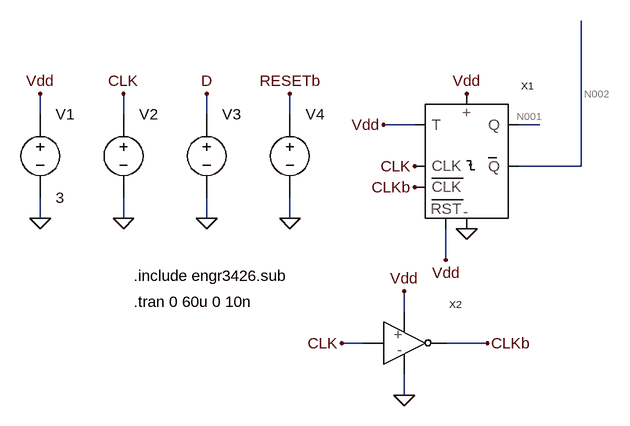
[diagram p0: schematic FlipFlop_test - Copy.asc]
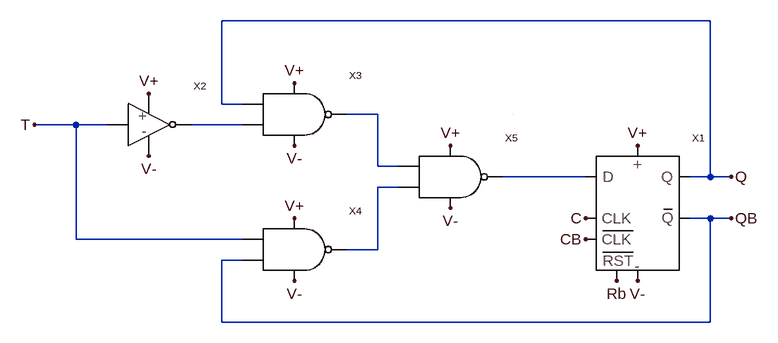
[diagram p1: sub-circuit t_flipflopreset_fe.asc]
FlipFlop_test - Copy.asc, the LTspice schematic file:
Version 4
SHEET 1 880 680
WIRE -464 80 -464 48
WIRE -336 80 -336 48
WIRE -208 80 -208 48
WIRE -80 80 -80 48
WIRE 112 96 64 96
WIRE 304 96 272 96
WIRE 368 160 368 -64
WIRE 368 160 272 160
WIRE -464 240 -464 208
WIRE -336 240 -336 208
WIRE -208 240 -208 208
WIRE -80 240 -80 208
WIRE 160 304 160 256
WIRE 96 384 96 352
WIRE 32 432 0 432
WIRE 224 432 160 432
WIRE 96 512 96 480
FLAG -464 240 0
FLAG -464 48 Vdd
FLAG -336 240 0
FLAG -336 48 CLK
FLAG -208 240 0
FLAG -208 48 D
FLAG 96 512 0
FLAG 96 352 Vdd
FLAG 0 432 CLK
FLAG 224 432 CLKb
FLAG 112 160 CLK
FLAG 112 192 CLKb
FLAG 192 256 0
FLAG 192 48 Vdd
FLAG -80 240 0
FLAG -80 48 RESETb
FLAG 160 304 Vdd
FLAG 64 96 Vdd
SYMBOL cktsym\\vsource -464 144 R0
WINDOW 123 0 0 Left 2
WINDOW 39 0 0 Left 2
SYMATTR Value 3
SYMATTR InstName V1
SYMBOL cktsym\\vsource -336 144 R0
WINDOW 3 48 16 Invisible 2
WINDOW 123 0 0 Left 2
WINDOW 39 0 0 Left 2
SYMATTR Value PULSE(0 3 5u 1n 1n 10u 20u)
SYMATTR InstName V2
SYMBOL cktsym\\vsource -208 144 R0
WINDOW 3 48 16 Invisible 2
WINDOW 123 0 0 Left 2
WINDOW 39 0 0 Left 2
SYMATTR Value PULSE(0 3 0.5u 1n 1n 20u 40u)
SYMATTR InstName V3
SYMBOL Inverter 96 432 R0
SYMATTR InstName X2
SYMBOL cktsym\\vsource -80 144 R0
WINDOW 3 48 12 Invisible 2
WINDOW 123 0 0 Left 2
WINDOW 39 0 0 Left 2
SYMATTR Value PWL(0 3 10u 3 10.05u 0 12u 0 12.05u .7 60u .7)
SYMATTR InstName V4
SYMBOL T_FlipFlopReset_FE 160 192 R0
SYMATTR InstName X1
TEXT -320 328 Left 2 !.include engr3426.sub
TEXT -320 368 Left 2 !.tran 0 60u 0 10n

t_flipflopreset_fe.asc, the sub-circuit schematic file:
Version 4
SHEET 1 880 680
WIRE 304 -144 -448 -144
WIRE -448 -16 -448 -144
WIRE -416 -16 -448 -16
WIRE -208 0 -256 0
WIRE -672 16 -736 16
WIRE -624 16 -672 16
WIRE -416 16 -496 16
WIRE -208 80 -208 0
WIRE -176 80 -208 80
WIRE 112 96 -16 96
WIRE 304 96 304 -144
WIRE 304 96 272 96
WIRE 336 96 304 96
WIRE -176 112 -208 112
WIRE 304 160 272 160
WIRE 336 160 304 160
WIRE -672 192 -672 16
WIRE -416 192 -672 192
WIRE -208 208 -208 112
WIRE -208 208 -256 208
WIRE -416 224 -448 224
WIRE -448 320 -448 224
WIRE 304 320 304 160
WIRE 304 320 -448 320
WIRE 0 0 0 0
FLAG 112 160 C
FLAG 112 192 CB
FLAG 160 256 Rb
FLAG -336 -48 V+
FLAG -336 48 V-
FLAG -336 160 V+
FLAG -336 256 V-
FLAG 192 48 V+
FLAG 192 256 V-
FLAG -560 -32 V+
FLAG -560 64 V-
FLAG -736 16 T
FLAG 336 96 Q
FLAG 336 160 QB
FLAG -96 48 V+
FLAG -96 144 V-
SYMBOL Inverter -560 16 R0
SYMATTR InstName X2
SYMATTR SpiceLine nmosL=0.9u nmosW=3u pmosL=0.9u pmosW=6u
SYMBOL FlipFlop 192 160 R0
SYMATTR InstName X1
SYMATTR SpiceLine nmosL=0.9u nmosW=3u pmosL=0.9u pmosW=6u
SYMBOL NAND -336 0 R0
SYMATTR InstName X3
SYMATTR SpiceLine nmosL=0.9u nmosW=3u pmosL=0.9u pmosW=6u
SYMBOL NAND -336 208 R0
SYMATTR InstName X4
SYMATTR SpiceLine nmosL=0.9u nmosW=3u pmosL=0.9u pmosW=6u
SYMBOL NAND -96 96 R0
SYMATTR InstName X5
SYMATTR SpiceLine nmosL=0.9u nmosW=3u pmosL=0.9u pmosW=6u

The netlist it stands for:
* FlipFlop_test - Copy.asc
V1 Vdd 0 3
V2 CLK 0 PULSE(0 3 5u 1n 1n 10u 20u)
V3 D 0 PULSE(0 3 0.5u 1n 1n 20u 40u)
XX2 CLK CLKb Vdd 0 Inverter  ; pins IN OUT pos neg
V4 RESETb 0 PWL(0 3 10u 3 10.05u 0 12u 0 12.05u .7 60u .7)
XX1 Vdd CLKb N001 N002 0 Vdd CLK Vdd t_flipflopreset_fe

* block symbol definitions
.subckt t_flipflopreset_fe T CB Q QB V- V+ C Rb
XX2 T N002 V+ V- Inverter nmosL=0.9u nmosW=3u pmosL=0.9u pmosW=6u  ; pins IN OUT pos neg
XX1 N003 C CB Q QB Rb V+ V- FlipFlop nmosL=0.9u nmosW=3u pmosL=0.9u pmosW=6u  ; pins D CLK CLKb Q Qb RESETb pos neg
XX3 Q N001 N002 V+ V- NAND nmosL=0.9u nmosW=3u pmosL=0.9u pmosW=6u  ; pins A OUT B Vdd GROUND
XX4 T N004 QB V+ V- NAND nmosL=0.9u nmosW=3u pmosL=0.9u pmosW=6u  ; pins A OUT B Vdd GROUND
XX5 N001 N003 N004 V+ V- NAND nmosL=0.9u nmosW=3u pmosL=0.9u pmosW=6u  ; pins A OUT B Vdd GROUND
.ends t_flipflopreset_fe

.include engr3426.sub
.tran 0 60u 0 10n
.backanno
.end

* Results of the author's LTspice run, read from the files saved beside the schematic
* Operating Point, zero values left out:
*   V(vdd) = 3 V
*   V(clkb) = 3 V
*   V(resetb) = 3 V
*   V(n002) = 1.048 V
*   V(n001) = 1.83 V
*   I(V1) = -609.5 µA
*   Ix(x2:VDD) = 6.01 pA
*   Ix(x2:GROUND) = -6.01 pA
*   Ix(x1:V-) = -609.5 µA
*   Ix(x1:V+) = 609.5 µA
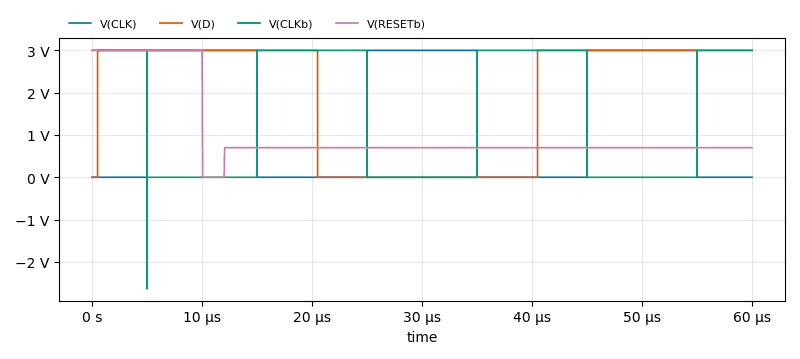
[diagram p2: Transient Analysis of FlipFlop_test - Copy.asc, plotted from the saved traces]
* Transient Analysis, 1 run:
*   V(CLK): min 0 V, max 3 V, average 1.5 V, rms 2.121 V, last 0 V
*   V(D): min 0 V, max 3 V, average 1.975 V, rms 2.434 V, last 3 V
*   V(CLKb): min -2.637 V, max 3 V, average 1.5 V, rms 2.121 V, last 3 V
*   V(RESETb): min 0 V, max 3 V, average 1.061 V, rms 1.377 V, last 700 mV